# EAGLE design ML_Interface_ExtenderA (EAGLE 8.6.3)
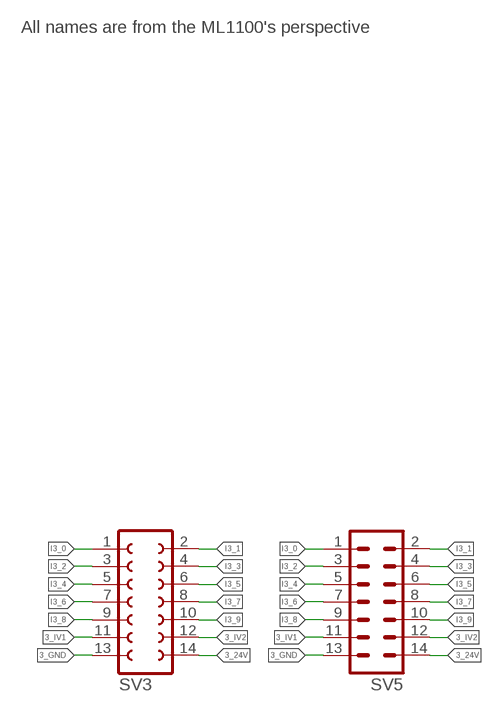
[diagram p0: schematic, sheet 1]

## Parts
SV3  FE07-2W  [FE07-2W]
SV5  MA07-2W  [MA07-2W]

## Nets
3_24V: SV3.14 SV5.14
3_GND: SV3.13 SV5.13
3_IV1: SV3.11 SV5.11
3_IV2: SV3.12 SV5.12
I3_0: SV3.1 SV5.1
I3_1: SV3.2 SV5.2
I3_2: SV3.3 SV5.3
I3_3: SV3.4 SV5.4
I3_4: SV3.5 SV5.5
I3_5: SV3.6 SV5.6
I3_6: SV3.7 SV5.7
I3_7: SV3.8 SV5.8
I3_8: SV3.9 SV5.9
I3_9: SV3.10 SV5.10

## Notes on the sheet
- All names are from the ML1100's perspective

## Library data of the parts
SV3 = con-lsta:FE07-2W: FEMALE HEADER; OC_FARNELL: unknown; OC_NEWARK: unknown
SV5 = con-lstb:MA07-2W: PIN HEADER; OC_FARNELL: unknown; OC_NEWARK: unknown

## Net classes
0 default: width 0.203 mm
1 ground: width 0.61 mm
2 signal_out: width 0.254 mm, clearance 0.152 mm

## Board
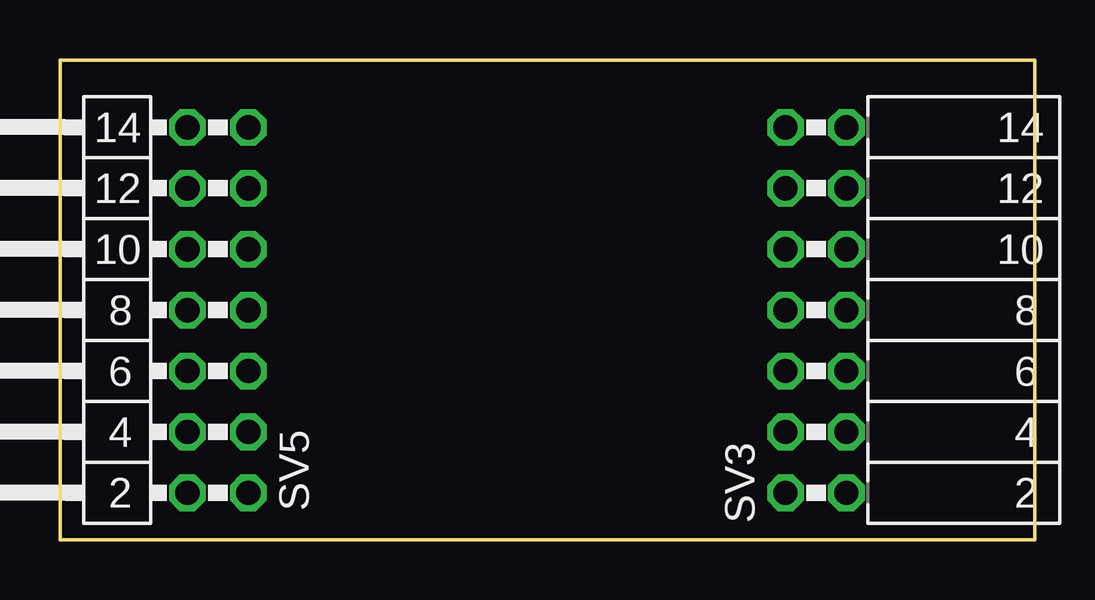
[diagram p1: board, top side]
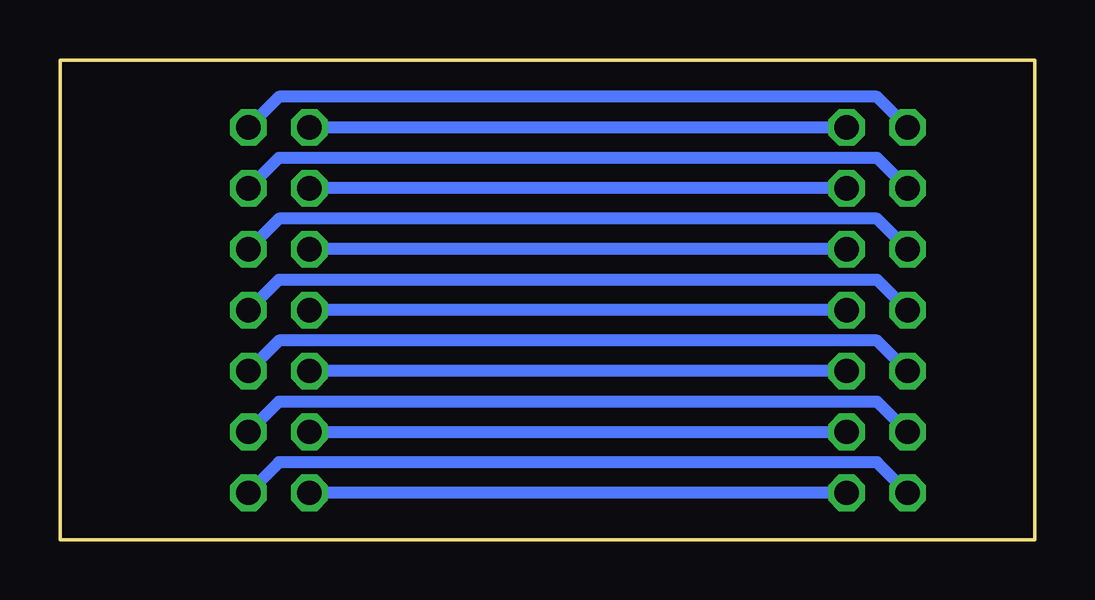
[diagram p2: board, bottom side, seen from below]

Size 40.64 x 20.02 mm. Coordinates in mm from the lower left corner, seen from the top.
Outline: 0,20.02 40.64,20.02 40.64,0 0,0 0,20.02
Copper layers (1*16): Top 0.035mm / dielectric 1.5mm / Bottom 0.035mm
Design rules "default *": minimum track width 10mil, minimum drill 0.35mm, track to track 10mil, track to pad 10mil, pad to pad 10mil, via to via 10mil, smd to smd 10mil, copper to edge 1mil, drill to drill 6mil, minimum pad ring 10mil, minimum via ring 8mil, stop-mask expansion 4mil, vias tented up to drill 0mil, thermal gap 10mil

### Footprints (pad centres in the part's own frame; a part is rotated, then mirrored left to right if it is on the bottom)
FE07-2W = drill 1.016 octagon: 1 -7.62,1.27; 2 -7.62,-1.27; 3 -5.08,1.27; 4 -5.08,-1.27; 5 -2.54,1.27; 6 -2.54,-1.27; 7 0,1.27; 8 0,-1.27; 9 2.54,1.27; 10 2.54,-1.27; 11 5.08,1.27; 12 5.08,-1.27; 13 7.62,1.27; 14 7.62,-1.27
MA07-2W = drill 1.016 octagon: 1 -7.62,-1.27; 2 -7.62,1.27; 3 -5.08,-1.27; 4 -5.08,1.27; 5 -2.54,-1.27; 6 -2.54,1.27; 7 0,-1.27; 8 0,1.27; 9 2.54,-1.27; 10 2.54,1.27; 11 5.08,-1.27; 12 5.08,1.27; 13 7.62,-1.27; 14 7.62,1.27

### Placement (x,y rotation side)
SV3  31.51,9.58 90 top
SV5  6.58,9.58 90 top

### Tracks (layer width: path | path; a pad name or v marks a point on that pad's centre or on a via)
3_24V
  Bottom 0.508: SV5.14 6.58,18.48 31.51,18.48 SV3.14
3_GND
  Bottom 0.508: SV3.13 SV5.13
3_IV1
  Bottom 0.508: SV5.11 SV3.11
3_IV2
  Bottom 0.508: SV3.12 31.51,15.94 6.58,15.94 SV5.12
I3_0
  Bottom 0.508: SV5.1 SV3.1
I3_1
  Bottom 0.508: SV5.2 6.58,3.23 31.51,3.23 SV3.2
I3_2
  Bottom 0.508: SV3.3 SV5.3
I3_3
  Bottom 0.508: SV3.4 31.51,5.78 6.58,5.78 SV5.4
I3_4
  Bottom 0.508: SV5.5 SV3.5
I3_5
  Bottom 0.508: SV5.6 6.58,8.31 31.51,8.31 SV3.6
I3_6
  Bottom 0.508: SV5.7 SV3.7
I3_7
  Bottom 0.508: SV3.8 31.51,10.86 6.58,10.86 SV5.8
I3_8
  Bottom 0.508: SV5.9 SV3.9
I3_9
  Bottom 0.508: SV5.10 6.58,13.4 31.51,13.4 SV3.10